# Altium schematic sheet Gas_Gauge.SchDoc
size 381 x 241 mm; SheetNumber: 1; SheetTotal: 1
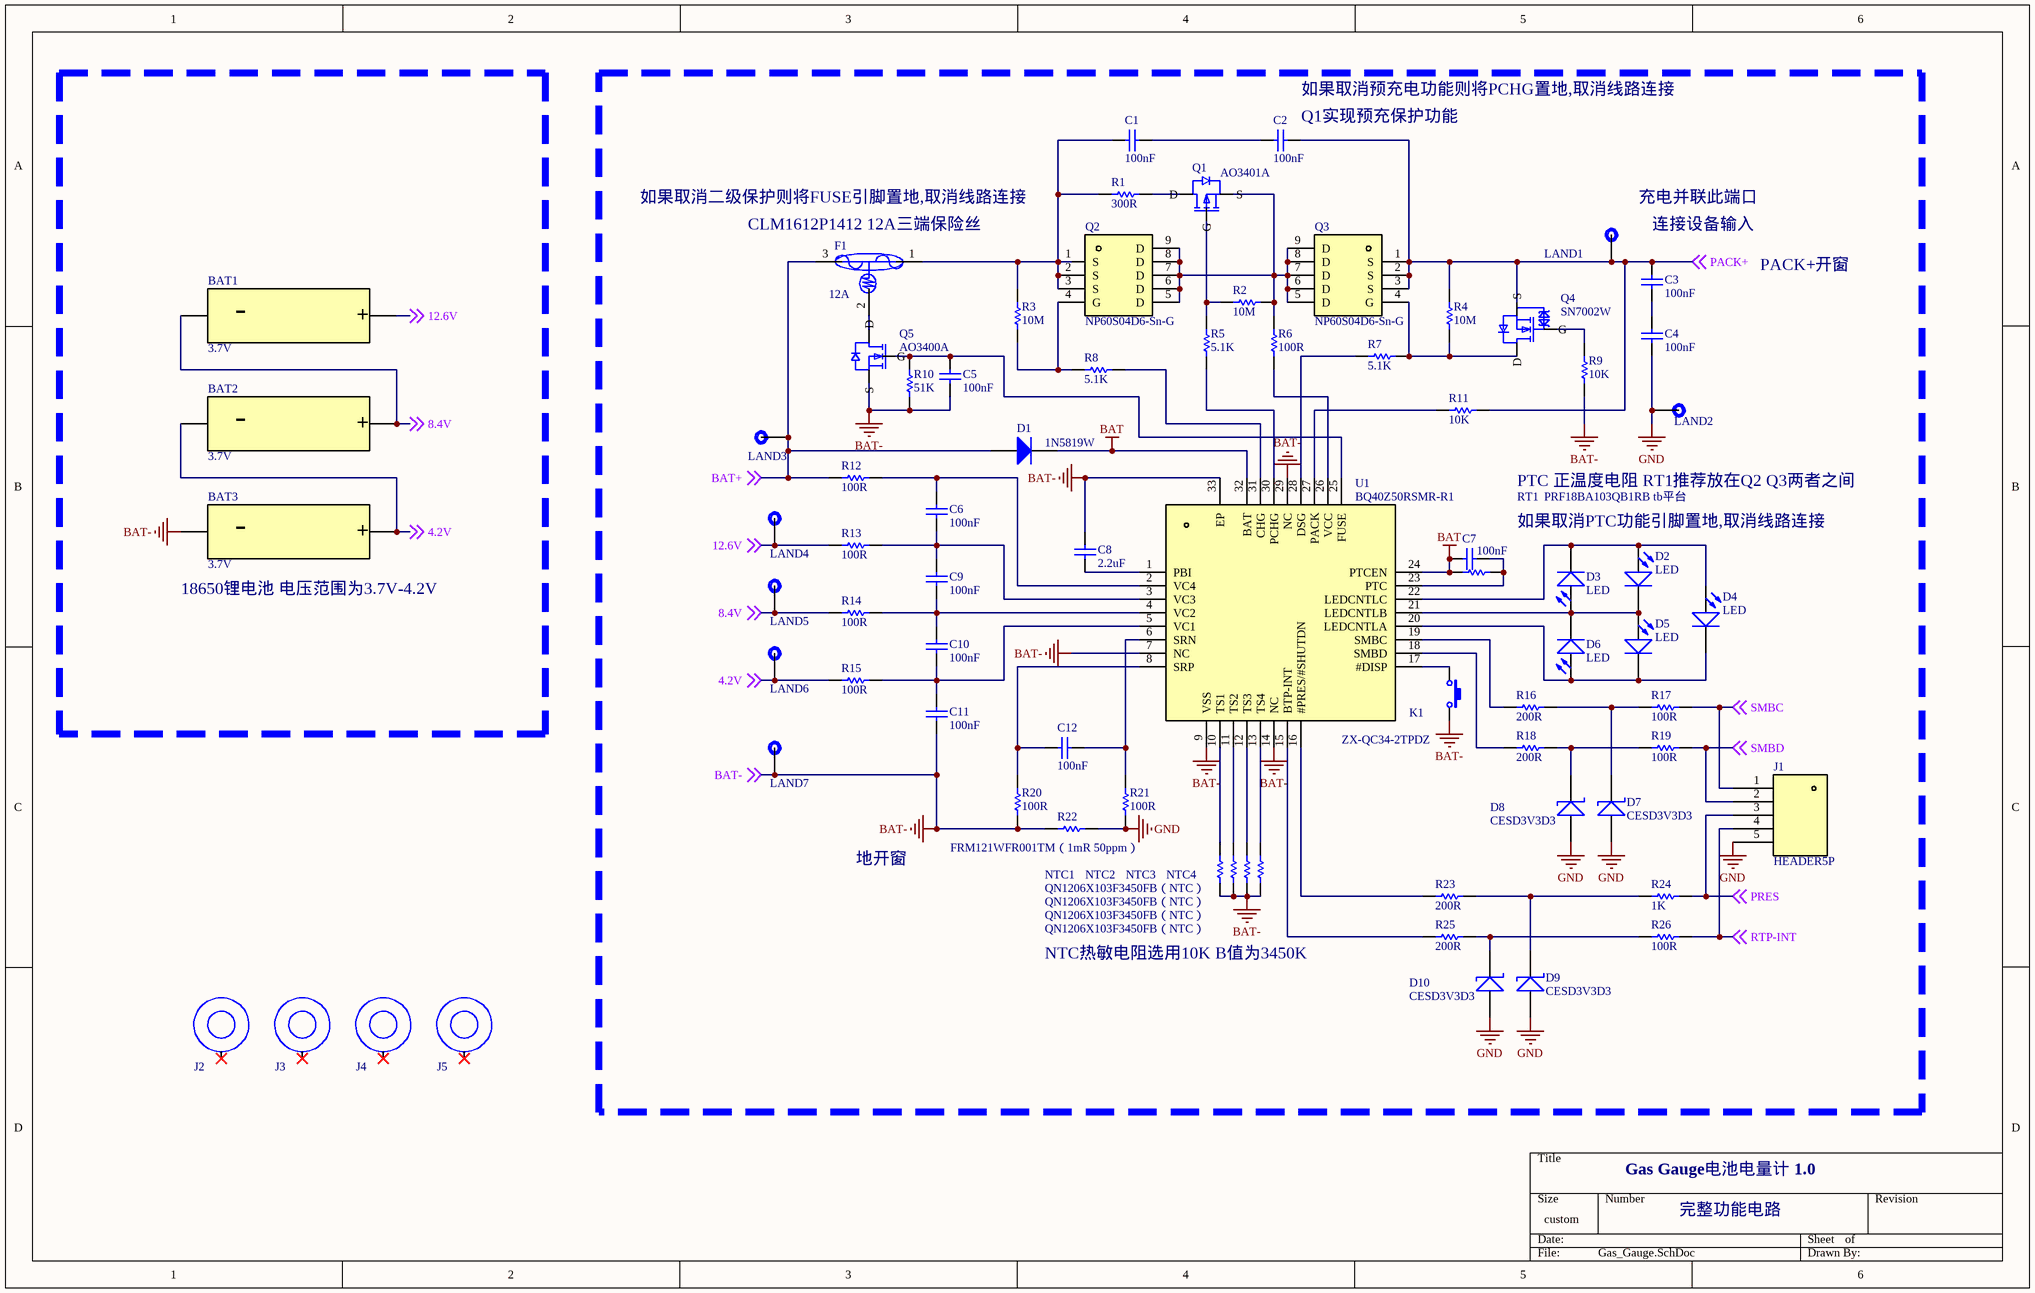
[diagram p0: Gas_Gauge.SchDoc]

## Parts
BAT1  3.7V  [BH-18650-B1BA002]
BAT2  3.7V  [BH-18650-B1BA002]
BAT3  3.7V  [BH-18650-B1BA002]
C1  100nF  [C0603]
C2  100nF  [C0603]
C3  100nF  [C0805]
C4  100nF  [C0805]
C5  100nF  [C0603]
C6  100nF  [C0603]
C7  100nF  [C0603]
C8  2.2uF  [C0603]
C9  100nF  [C0603]
C10  100nF  [C0603]
C11  100nF  [C0603]
C12  100nF  [C0603]
D1  1N5819W  [DIODE_SOD-123]
D2  LED  [LED0603]
D3  LED  [LED0603]
D4  LED  [LED0603]
D5  LED  [LED0603]
D6  LED  [LED0603]
D7  CESD3V3D3  [CESD3V3D3]
D8  CESD3V3D3  [CESD3V3D3]
D9  CESD3V3D3  [CESD3V3D3]
D10  CESD3V3D3  [CESD3V3D3]
F1  12A  [CLM1612P1412]
J1  HEADER5P  [HEADER5P]
J2  NONE  [J-LOCATION]  (value not drawn)
J3  NONE  [J-LOCATION]  (value not drawn)
J4  NONE  [J-LOCATION]  (value not drawn)
J5  NONE  [J-LOCATION]  (value not drawn)
K1  ZX-QC34-2TPDZ  [ZX-QC34-2TPDZ]
LAND1  LAND  [LAND]  (value not drawn)
LAND2  LAND  [LAND]  (value not drawn)
LAND3  LAND  [LAND]  (value not drawn)
LAND4  LAND  [LAND1]  (value not drawn)
LAND5  LAND  [LAND1]  (value not drawn)
LAND6  LAND  [LAND1]  (value not drawn)
LAND7  LAND  [LAND]  (value not drawn)
NTC1  QN1206X103F3450FB（NTC）  [R1206]
NTC2  QN1206X103F3450FB（NTC）  [R1206]
NTC3  QN1206X103F3450FB（NTC）  [R1206]
NTC4  QN1206X103F3450FB（NTC）  [R1206]
Q1  AO3401A  [AO3401A]
Q2  NP60S04D6-Sn-G  [NP60S04D6-Sn-G]
Q3  NP60S04D6-Sn-G  [NP60S04D6-Sn-G]
Q4  SN7002W  [SN7002W]
Q5  AO3400A  [AO3400A]
R1  300R  [R1812]
R2  10M  [R0603]
R3  10M  [R0603]
R4  10M  [R0603]
R5  5.1K  [R0603]
R6  100R  [R0603]
R7  5.1K  [R0603]
R8  5.1K  [R0603]
R9  10K  [R0603]
R10  51K  [R0603]
R11  10K  [R0603]
R12  100R  [R0603]
R13  100R  [R0603]
R14  100R  [R0603]
R15  100R  [R0603]
R16  200R  [R0603]
R17  100R  [R0603]
R18  200R  [R0603]
R19  100R  [R0603]
R20  100R  [R0603]
R21  100R  [R0603]
R22  FRM121WFR001TM（1mR 50ppm）  [R1206]
R23  200R  [R0603]
R24  1K  [R0603]
R25  200R  [R0603]
R26  100R  [R0603]
RT1  PRF18BA103QB1RB tb平台  [R0603]
U1  BQ40Z50RSMR-R1  [BQ40Z50RSMR-R1]

## Blocks framed on the sheet
18650锂电池 电压范围为3.7V-4.2V: BAT1-BAT3

## Nets
BAT: C7.1 D1.2(K) RT1.2 U1.24(PTCEN) U1.32(BAT)
BAT-: BAT3.1(-) C5.2 C8.1 C11.2 K1.2 LAND7.1 NTC1.1 NTC2.1 NTC3.1 NTC4.1 Q5.2(S) R9.1 R10.1 R20.1 R22.1 U1.7(NC) U1.9(VSS) U1.14(NC) U1.29(NC) U1.33(EP) ; off-sheet BAT-
GND: C4.1 D7.2 D8.2 D9.2 D10.2 J1.5 LAND2.1 R21.1 R22.2
4.2V: BAT2.1(-) BAT3.2(+) LAND6.1 R15.1 ; off-sheet 4.2V
8.4V: BAT1.1(-) BAT2.2(+) LAND5.1 R14.1 ; off-sheet 8.4V
12.6V: BAT1.2(+) LAND4.1 R13.1 ; off-sheet 12.6V
BAT+: D1.1(A) F1.3 LAND3.1 R12.1 ; off-sheet BAT+
PACK+: C2.1 C3.1 LAND1.1 Q3.1(S) Q3.2(S) Q3.3(S) Q4.2(S) R4.2 R11.1 ; off-sheet PACK+
PRES: J1.3 R24.1 ; off-sheet PRES
RTP-INT: J1.4 R26.1 ; off-sheet RTP-INT
SMBC: J1.1 R17.1 ; off-sheet SMBC
SMBD: J1.2 R19.1 ; off-sheet SMBD
NetC1_1: C1.1 C2.2
NetC1_2: C1.2 F1.1 Q2.1(S) Q2.2(S) Q2.3(S) R1.1 R3.2
NetC3_2: C3.2 C4.2
NetC5_1: C5.1 Q5.1(G) R10.2 U1.25(FUSE)
NetC6_1: C6.1 R12.2 U1.2(VC4)
NetC6_2: C6.2 C9.1 R13.2 U1.3(VC3)
NetC7_2: C7.2 RT1.1 U1.23(PTC)
NetC8_2: C8.2 U1.1(PBI)
NetC9_2: C9.2 C10.1 R14.2 U1.4(VC2)
NetC10_2: C10.2 C11.1 R15.2 U1.5(VC1)
NetC12_1: C12.1 R20.2 U1.8(SRP)
NetC12_2: C12.2 R21.2 U1.6(SRN)
NetD2_A: D2.A D3.K D4.A U1.22(LEDCNTLC)
NetD2_K: D2.K D3.A D5.A D6.K U1.21(LEDCNTLB)
NetD4_K: D4.K D5.K D6.A U1.20(LEDCNTLA)
NetD7_1: D7.1 R16.1 R17.2
NetD8_1: D8.1 R18.1 R19.2
NetD9_1: D9.1 R23.1 R24.2
NetD10_1: D10.1 R25.1 R26.2
NetF1_2: F1.2 Q5.3(D)
NetK1_1: K1.1 U1.17(#DISP)
NetNTC1_2: NTC1.2 U1.10(TS1)
NetNTC2_2: NTC2.2 U1.11(TS2)
NetNTC3_2: NTC3.2 U1.12(TS3)
NetNTC4_2: NTC4.2 U1.13(TS4)
NetQ1_1: Q1.1(G) R2.1 R5.2
NetQ1_2: Q1.2(S) Q2.5(D) Q2.6(D) Q2.7(D) Q2.8(D) Q2.9(D) Q3.5(D) Q3.6(D) Q3.7(D) Q3.8(D) Q3.9(D) R2.2 R6.2
NetQ1_3: Q1.3(D) R1.2
NetQ2_4: Q2.4(G) R3.1 R8.2
NetQ3_4: Q3.4(G) Q4.3(D) R4.1 R7.2
NetQ4_1: Q4.1(G) R9.2
NetR5_1: R5.1 U1.30(PCHG)
NetR6_1: R6.1 U1.26(VCC)
NetR7_1: R7.1 U1.28(DSG)
NetR8_1: R8.1 U1.31(CHG)
NetR11_2: R11.2 U1.27(PACK)
NetR16_2: R16.2 U1.19(SMBC)
NetR18_2: R18.2 U1.18(SMBD)
NetR23_2: R23.2 U1.16(#PRES/#SHUTDN)
NetR25_2: R25.2 U1.15(BTP-INT)

Not connected (* = marked no-connect by the designer): J2 0(Loc)*; J3 0(Loc)*; J4 0(Loc)*; J5 0(Loc)*

## Notes on the sheet
- (near C2) 如果取消预充电功能则将PCHG置地,取消线路连接
- (near C2) Q1实现预充保护功能
- 如果取消二级保护则将FUSE引脚置地,取消线路连接
- (near F1) CLM1612P1412 12A三端保险丝
- (near LAND1) 充电并联此端口
- 连接设备输入
- PACK+开窗
- PTC 正温度电阻 RT1推荐放在Q2 Q3两者之间
- 如果取消PTC功能引脚置地,取消线路连接
- 地开窗
- NTC热敏电阻选用10K B值为3450K
- Gas Gauge电池电量计 1.0
- 完整功能电路

## Library data of the parts
BAT1-BAT3 = BH-18650-B1BA002: 适用电池18650平头电芯座
C1-C12 = CAP: 独石电容
D1 = DIODE: 二极管; Published: 8-Jun-2000; LatestRevisionDate: 17-Jul-2002; LatestRevisionNote: Re-released for DXP Platform.; DatasheetVersion: 1998; PackageVersion: Aug-1999; PackageReference: DO-41; Publisher: Altium Limited; PackageDescription: Diode, Axial; Body 5.2 x 2.7 mm (LxDia. max), Lead Dia. 0.86 mm (max); Code_JEDEC: DO-204-AL; ComponentLink1Description: Manufacturer Link; ComponentLink1URL: http://www.fairchildsemi.com/; ComponentLink2Description: Datasheet; ComponentLink2URL: http://www.fairchildsemi.com/ds/1N%2F1N4001.pdf
D2-D6 = LED: 贴片LED
D7-D10 = CESD3V3D3: 静电和浪涌保护(TVS),反向截止电压(Vrwm):3.3V,钳位电压:13V,峰值脉冲电流(Ipp):16A。
F1 = CLM1612P1412: 4串锂电池三端保险丝 12A
J1 = HEADER5P: 5P排针
J2-J5 = J-LOCATION: 定位孔
K1 = ZX-QC34-2TPDZ: 3*4*2贴片开关带柱
LAND1-LAND7 = LAND: 测试焊盘
NTC1-NTC4 R1-R26 RT1 = RES: 电阻
Q1 = AO3401A: PMOS UMW(友台半导体) / 漏源电压(Vdss):30V / 连续漏极电流(Id):4.2A / 导通电阻(RDS(on)):50mΩ@10V
Q2 Q3 = NP60S04D6-Sn-G: NMOS natlinear(南麟) / 漏源电压(Vdss):40V / 连续漏极电流(Id):60A / 导通电阻(RDS(on)):5.9mR
Q4 = SN7002W: NMOS Leiditech(雷卯电子) / 漏源电压(Vdss):60V / 连续漏极电流(Id):115mA / 导通电阻(RDS(on)):1.4Ω
Q5 = AO3400A: NMOS UMW(友台半导体) / 漏源电压(Vdss):30V / 连续漏极电流(Id):5.8A / 耗散功率(Pd):1.4W。
U1 = BQ40Z50RSMR-R1: BQ40Z50-R1支持涡轮模式1.0的1至4节串联锂离子电池组管理器(锂电池电量计)